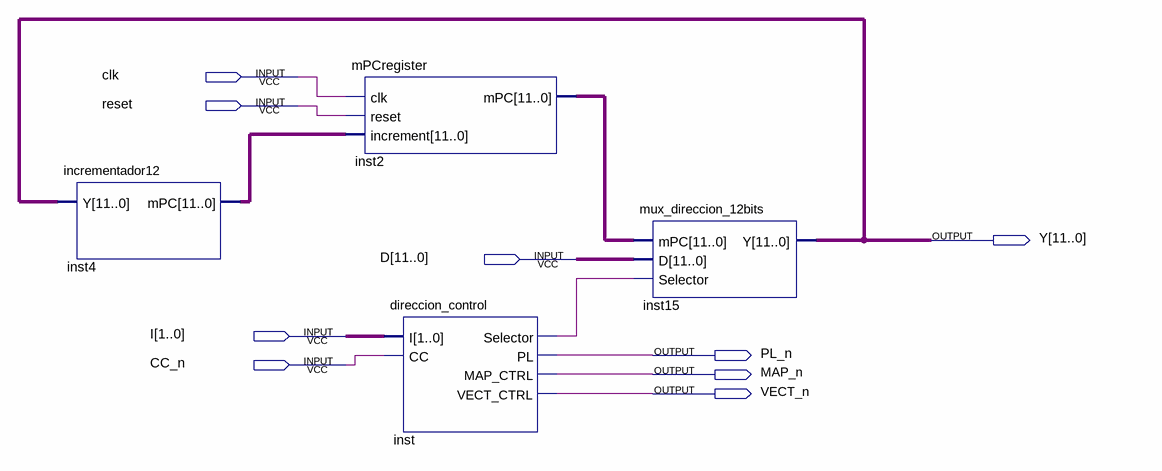
[diagram p0: schematic sheet]
// Quartus schematic secuenciador.bdf as structural Verilog: 4 symbols, 9 pins
module secuenciador (
  input  clk,
  input  reset,
  input  [11:0] D,
  input  [1:0] I,
  input  CC_n,
  output [11:0] Y,
  output PL_n,
  output MAP_n,
  output VECT_n
);

  wire inst_selector;
  wire [11:0] inst2_mpc, inst4_mpc;

  incrementador12 inst4 (.Y(Y), .mPC(inst4_mpc));
  mPCregister inst2 (.clk(clk), .reset(reset), .increment(inst4_mpc), .mPC(inst2_mpc));
  direccion_control inst (.I(I), .CC(CC_n), .Selector(inst_selector), .PL(PL_n), .MAP_CTRL(MAP_n), .VECT_CTRL(VECT_n));
  mux_direccion_12bits inst15 (.mPC(inst2_mpc), .D(D), .Selector(inst_selector), .Y(Y));
endmodule
